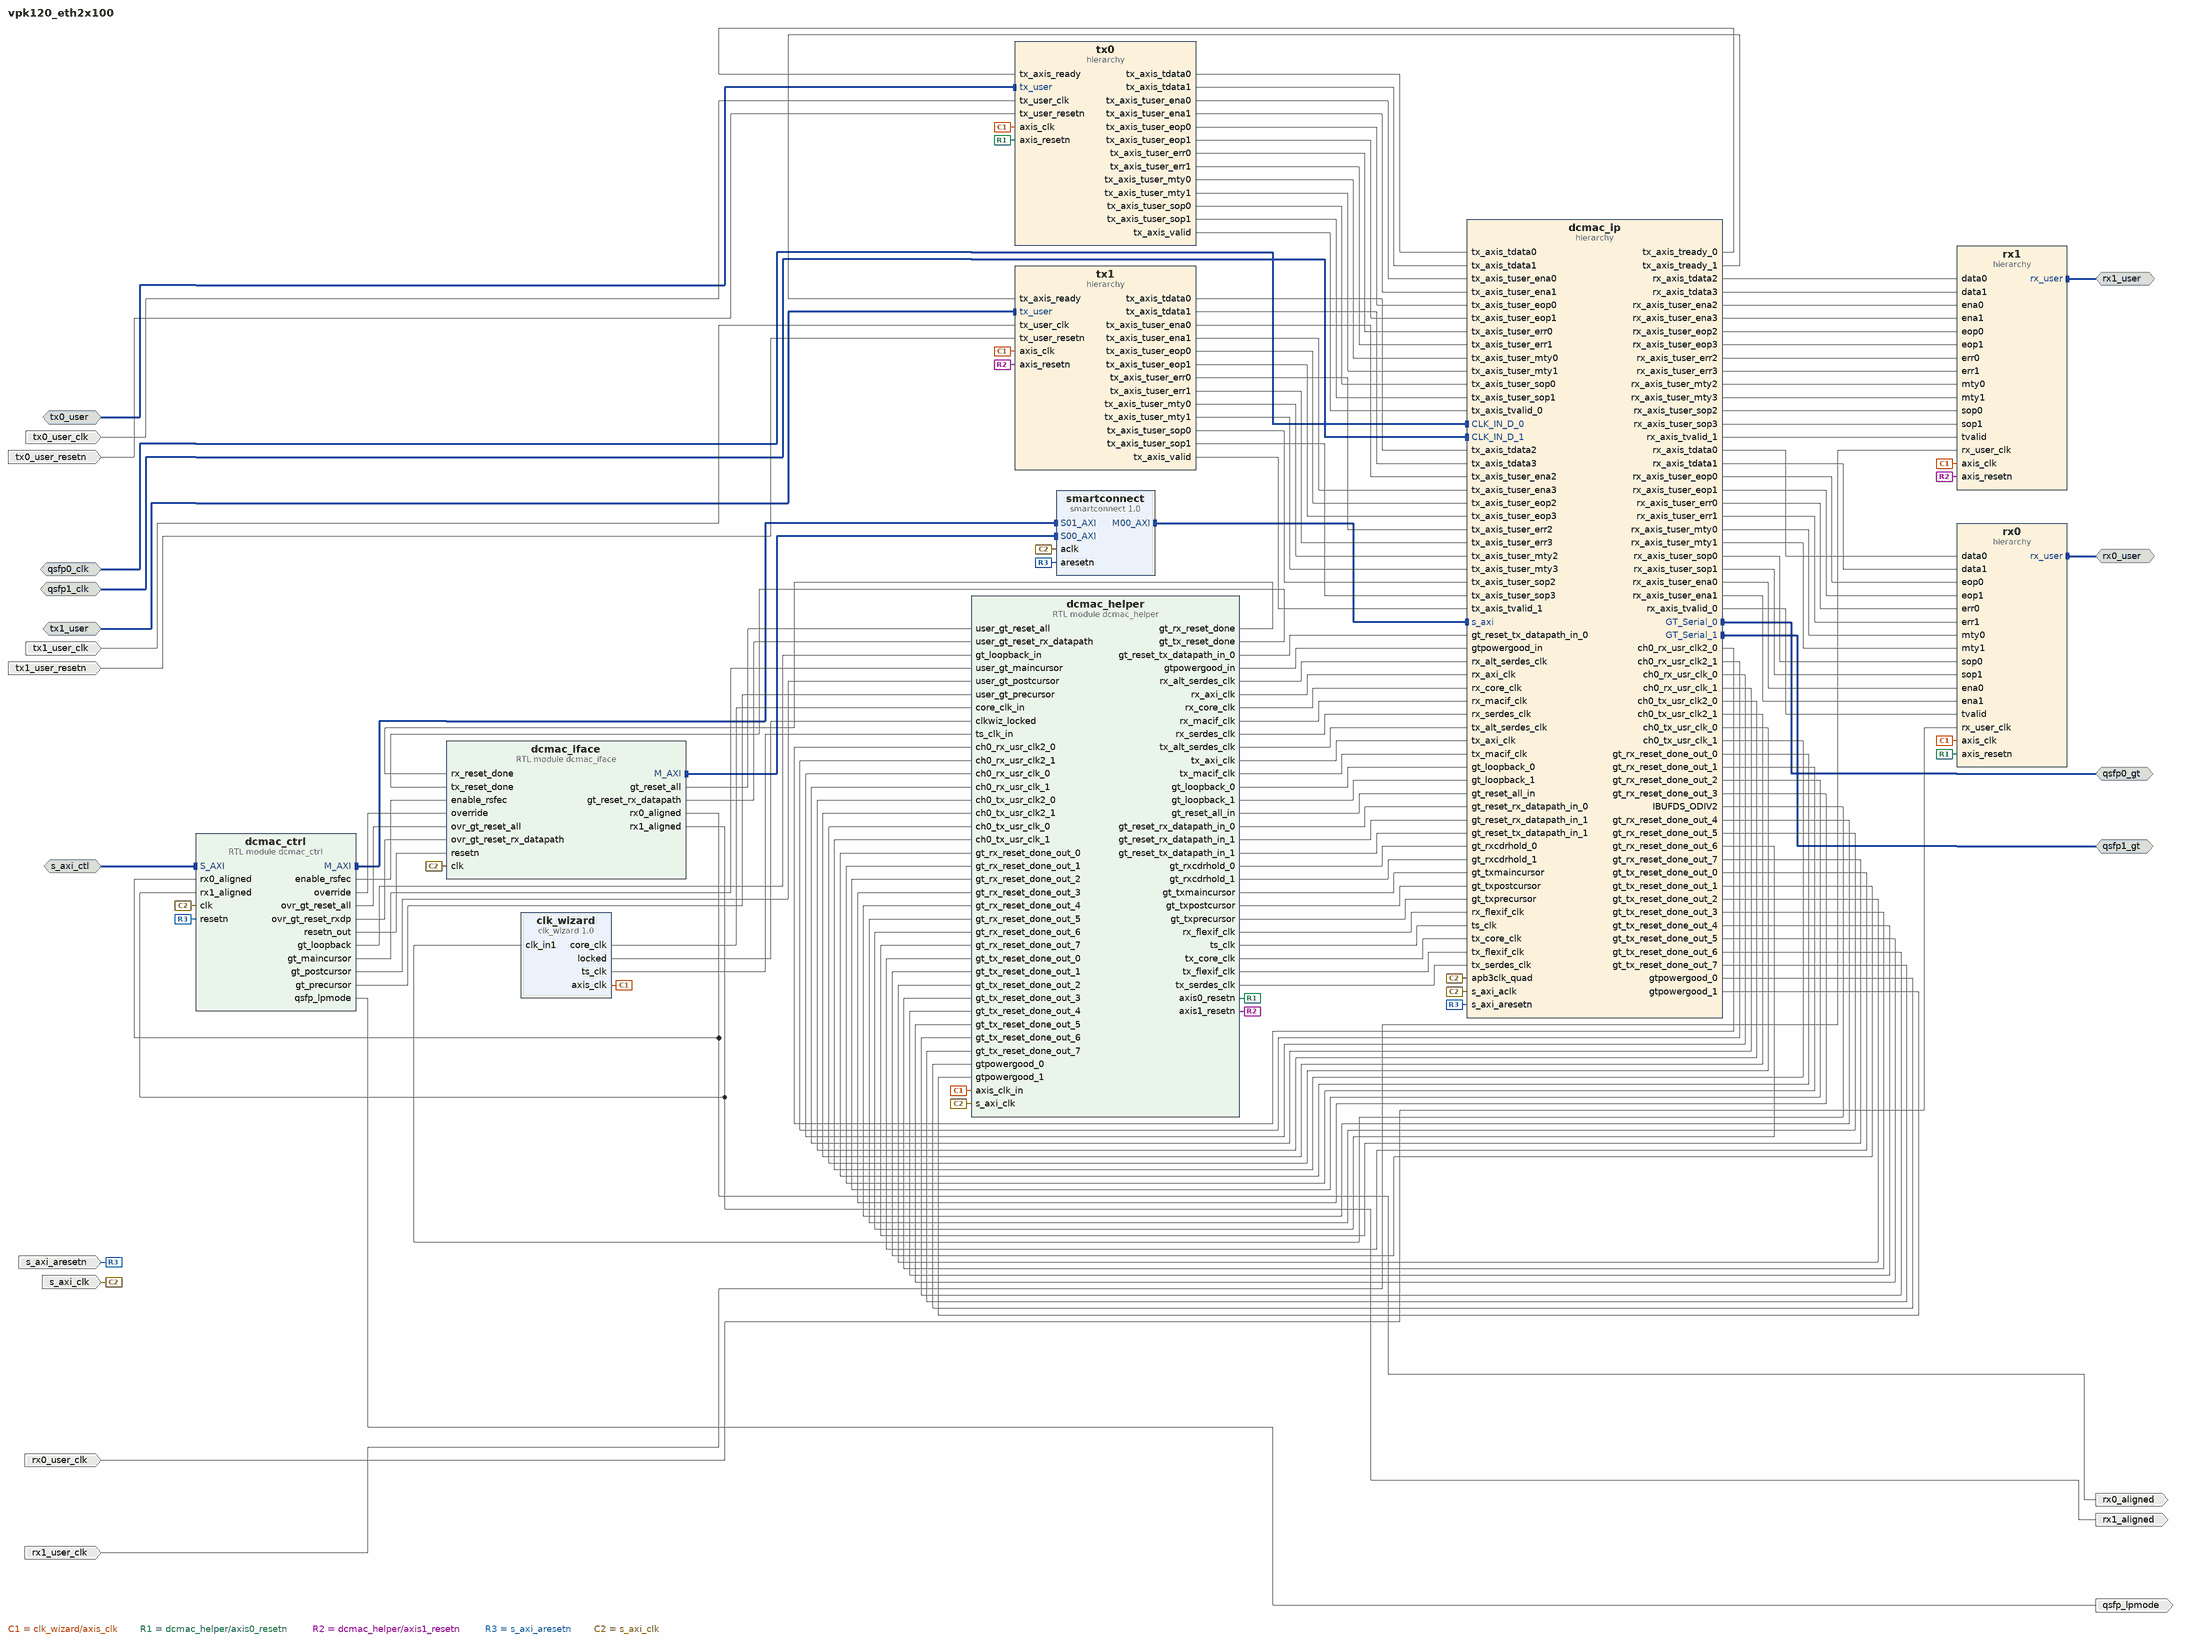
[diagram p0: block diagram of the top level]
# Vivado block design vpk120_eth2x100, xcvp1202-vsva2785-2MP-e-S, Vivado 2024.2
create_bd_design vpk120_eth2x100

create_bd_intf_port -mode Master -vlnv xilinx.com:interface:gt_rtl:1.0 qsfp0_gt
create_bd_intf_port -mode Master -vlnv xilinx.com:interface:gt_rtl:1.0 qsfp1_gt
create_bd_intf_port -mode Slave -vlnv xilinx.com:interface:diff_clock_rtl:1.0 qsfp0_clk
set_property -dict {CONFIG.FREQ_HZ 156250000} [get_bd_intf_ports qsfp0_clk]
create_bd_intf_port -mode Slave -vlnv xilinx.com:interface:diff_clock_rtl:1.0 qsfp1_clk
set_property -dict {CONFIG.FREQ_HZ 156250000} [get_bd_intf_ports qsfp1_clk]
create_bd_intf_port -mode Slave -vlnv xilinx.com:interface:aximm_rtl:1.0 s_axi_ctl
set_property -dict [list \
  CONFIG.ADDR_WIDTH 16 \
  CONFIG.ARUSER_WIDTH 0 \
  CONFIG.AWUSER_WIDTH 0 \
  CONFIG.BUSER_WIDTH 0 \
  CONFIG.DATA_WIDTH 32 \
  CONFIG.FREQ_HZ 249997499 \
  CONFIG.HAS_BRESP 1 \
  CONFIG.HAS_BURST 0 \
  CONFIG.HAS_CACHE 0 \
  CONFIG.HAS_LOCK 0 \
  CONFIG.HAS_PROT 1 \
  CONFIG.HAS_QOS 0 \
  CONFIG.HAS_REGION 0 \
  CONFIG.HAS_RRESP 1 \
  CONFIG.HAS_WSTRB 1 \
  CONFIG.ID_WIDTH 0 \
  CONFIG.NUM_READ_OUTSTANDING 1 \
  CONFIG.NUM_READ_THREADS 1 \
  CONFIG.NUM_WRITE_OUTSTANDING 1 \
  CONFIG.NUM_WRITE_THREADS 1 \
  CONFIG.PROTOCOL AXI4LITE \
  CONFIG.READ_WRITE_MODE READ_WRITE \
  CONFIG.RUSER_BITS_PER_BYTE 0 \
  CONFIG.RUSER_WIDTH 0 \
  CONFIG.WUSER_BITS_PER_BYTE 0 \
  CONFIG.WUSER_WIDTH 0 \
] [get_bd_intf_ports s_axi_ctl]
create_bd_intf_port -mode Slave -vlnv xilinx.com:interface:axis_rtl:1.0 tx0_user
set_property -dict [list \
  CONFIG.FREQ_HZ 250000000 \
  CONFIG.HAS_TKEEP 1 \
  CONFIG.HAS_TLAST 1 \
  CONFIG.HAS_TREADY 1 \
  CONFIG.HAS_TSTRB 0 \
  CONFIG.LAYERED_METADATA undef \
  CONFIG.TDATA_NUM_BYTES 64 \
  CONFIG.TDEST_WIDTH 0 \
  CONFIG.TID_WIDTH 0 \
  CONFIG.TUSER_WIDTH 0 \
] [get_bd_intf_ports tx0_user]
create_bd_intf_port -mode Slave -vlnv xilinx.com:interface:axis_rtl:1.0 tx1_user
set_property -dict [list \
  CONFIG.FREQ_HZ 250000000 \
  CONFIG.HAS_TKEEP 1 \
  CONFIG.HAS_TLAST 1 \
  CONFIG.HAS_TREADY 1 \
  CONFIG.HAS_TSTRB 0 \
  CONFIG.LAYERED_METADATA undef \
  CONFIG.TDATA_NUM_BYTES 64 \
  CONFIG.TDEST_WIDTH 0 \
  CONFIG.TID_WIDTH 0 \
  CONFIG.TUSER_WIDTH 0 \
] [get_bd_intf_ports tx1_user]
create_bd_intf_port -mode Master -vlnv xilinx.com:interface:axis_rtl:1.0 rx1_user
set_property -dict {CONFIG.FREQ_HZ 250000000} [get_bd_intf_ports rx1_user]
create_bd_intf_port -mode Master -vlnv xilinx.com:interface:axis_rtl:1.0 rx0_user
set_property -dict {CONFIG.CLK_DOMAIN vpk120_eth2x100_rx0_user_clk CONFIG.FREQ_HZ 250000000} [get_bd_intf_ports rx0_user]
create_bd_port -dir I -type rst s_axi_aresetn
create_bd_port -dir I -type clk s_axi_clk
set_property -dict {CONFIG.ASSOCIATED_BUSIF s_axi_ctl CONFIG.FREQ_HZ 249997499} [get_bd_ports s_axi_clk]
create_bd_port -dir I tx0_user_resetn
create_bd_port -dir I tx1_user_resetn
create_bd_port -dir I -type clk tx0_user_clk
set_property -dict {CONFIG.ASSOCIATED_BUSIF tx0_user CONFIG.FREQ_HZ 250000000} [get_bd_ports tx0_user_clk]
create_bd_port -dir I -type clk tx1_user_clk
set_property -dict {CONFIG.ASSOCIATED_BUSIF tx1_user CONFIG.FREQ_HZ 250000000} [get_bd_ports tx1_user_clk]
create_bd_port -dir I -type clk rx1_user_clk
set_property -dict {CONFIG.FREQ_HZ 250000000} [get_bd_ports rx1_user_clk]
create_bd_port -dir I -type clk rx0_user_clk
set_property -dict [list \
  CONFIG.ASSOCIATED_BUSIF rx0_user \
  CONFIG.CLK_DOMAIN vpk120_eth2x100_rx0_user_clk \
  CONFIG.FREQ_HZ 250000000 \
] [get_bd_ports rx0_user_clk]
create_bd_port -dir O rx0_aligned
create_bd_port -dir O rx1_aligned
create_bd_port -dir O qsfp_lpmode

create_bd_cell -type hier dcmac_ip
create_bd_cell -type module -reference dcmac_helper dcmac_helper
create_bd_cell -type ip -vlnv xilinx.com:ip:clk_wizard:1.0 clk_wizard
set_property -dict [list \
  CONFIG.CLKOUT_DRIVES BUFG,BUFG,BUFG,BUFG,BUFG,BUFG,BUFG \
  CONFIG.CLKOUT_DYN_PS None,None,None,None,None,None,None \
  CONFIG.CLKOUT_GROUPING Auto,Auto,Auto,Auto,Auto,Auto,Auto \
  CONFIG.CLKOUT_MATCHED_ROUTING false,false,false,false,false,false,false \
  CONFIG.CLKOUT_PORT core_clk,axis_clk,ts_clk,clk_out4,clk_out5,clk_out6,clk_out7 \
  CONFIG.CLKOUT_REQUESTED_DUTY_CYCLE 50.000,50.000,50.000,50.000,50.000,50.000,50.000 \
  CONFIG.CLKOUT_REQUESTED_OUT_FREQUENCY 782,390.625,300,100.000,100.000,100.000,100.000 \
  CONFIG.CLKOUT_REQUESTED_PHASE 0.000,0.000,0.000,0.000,0.000,0.000,0.000 \
  CONFIG.CLKOUT_USED true,true,true,false,false,false,false \
  CONFIG.PRIM_SOURCE Global_buffer \
  CONFIG.USE_LOCKED true \
] [get_bd_cells clk_wizard]
create_bd_cell -type module -reference dcmac_ctrl dcmac_ctrl
create_bd_cell -type hier rx0
create_bd_cell -type hier tx0
create_bd_cell -type hier tx1
create_bd_cell -type hier rx1
create_bd_cell -type ip -vlnv xilinx.com:ip:smartconnect:1.0 smartconnect
create_bd_cell -type module -reference dcmac_iface dcmac_iface

# ---- hierarchy /dcmac_ip ----
current_bd_instance /dcmac_ip
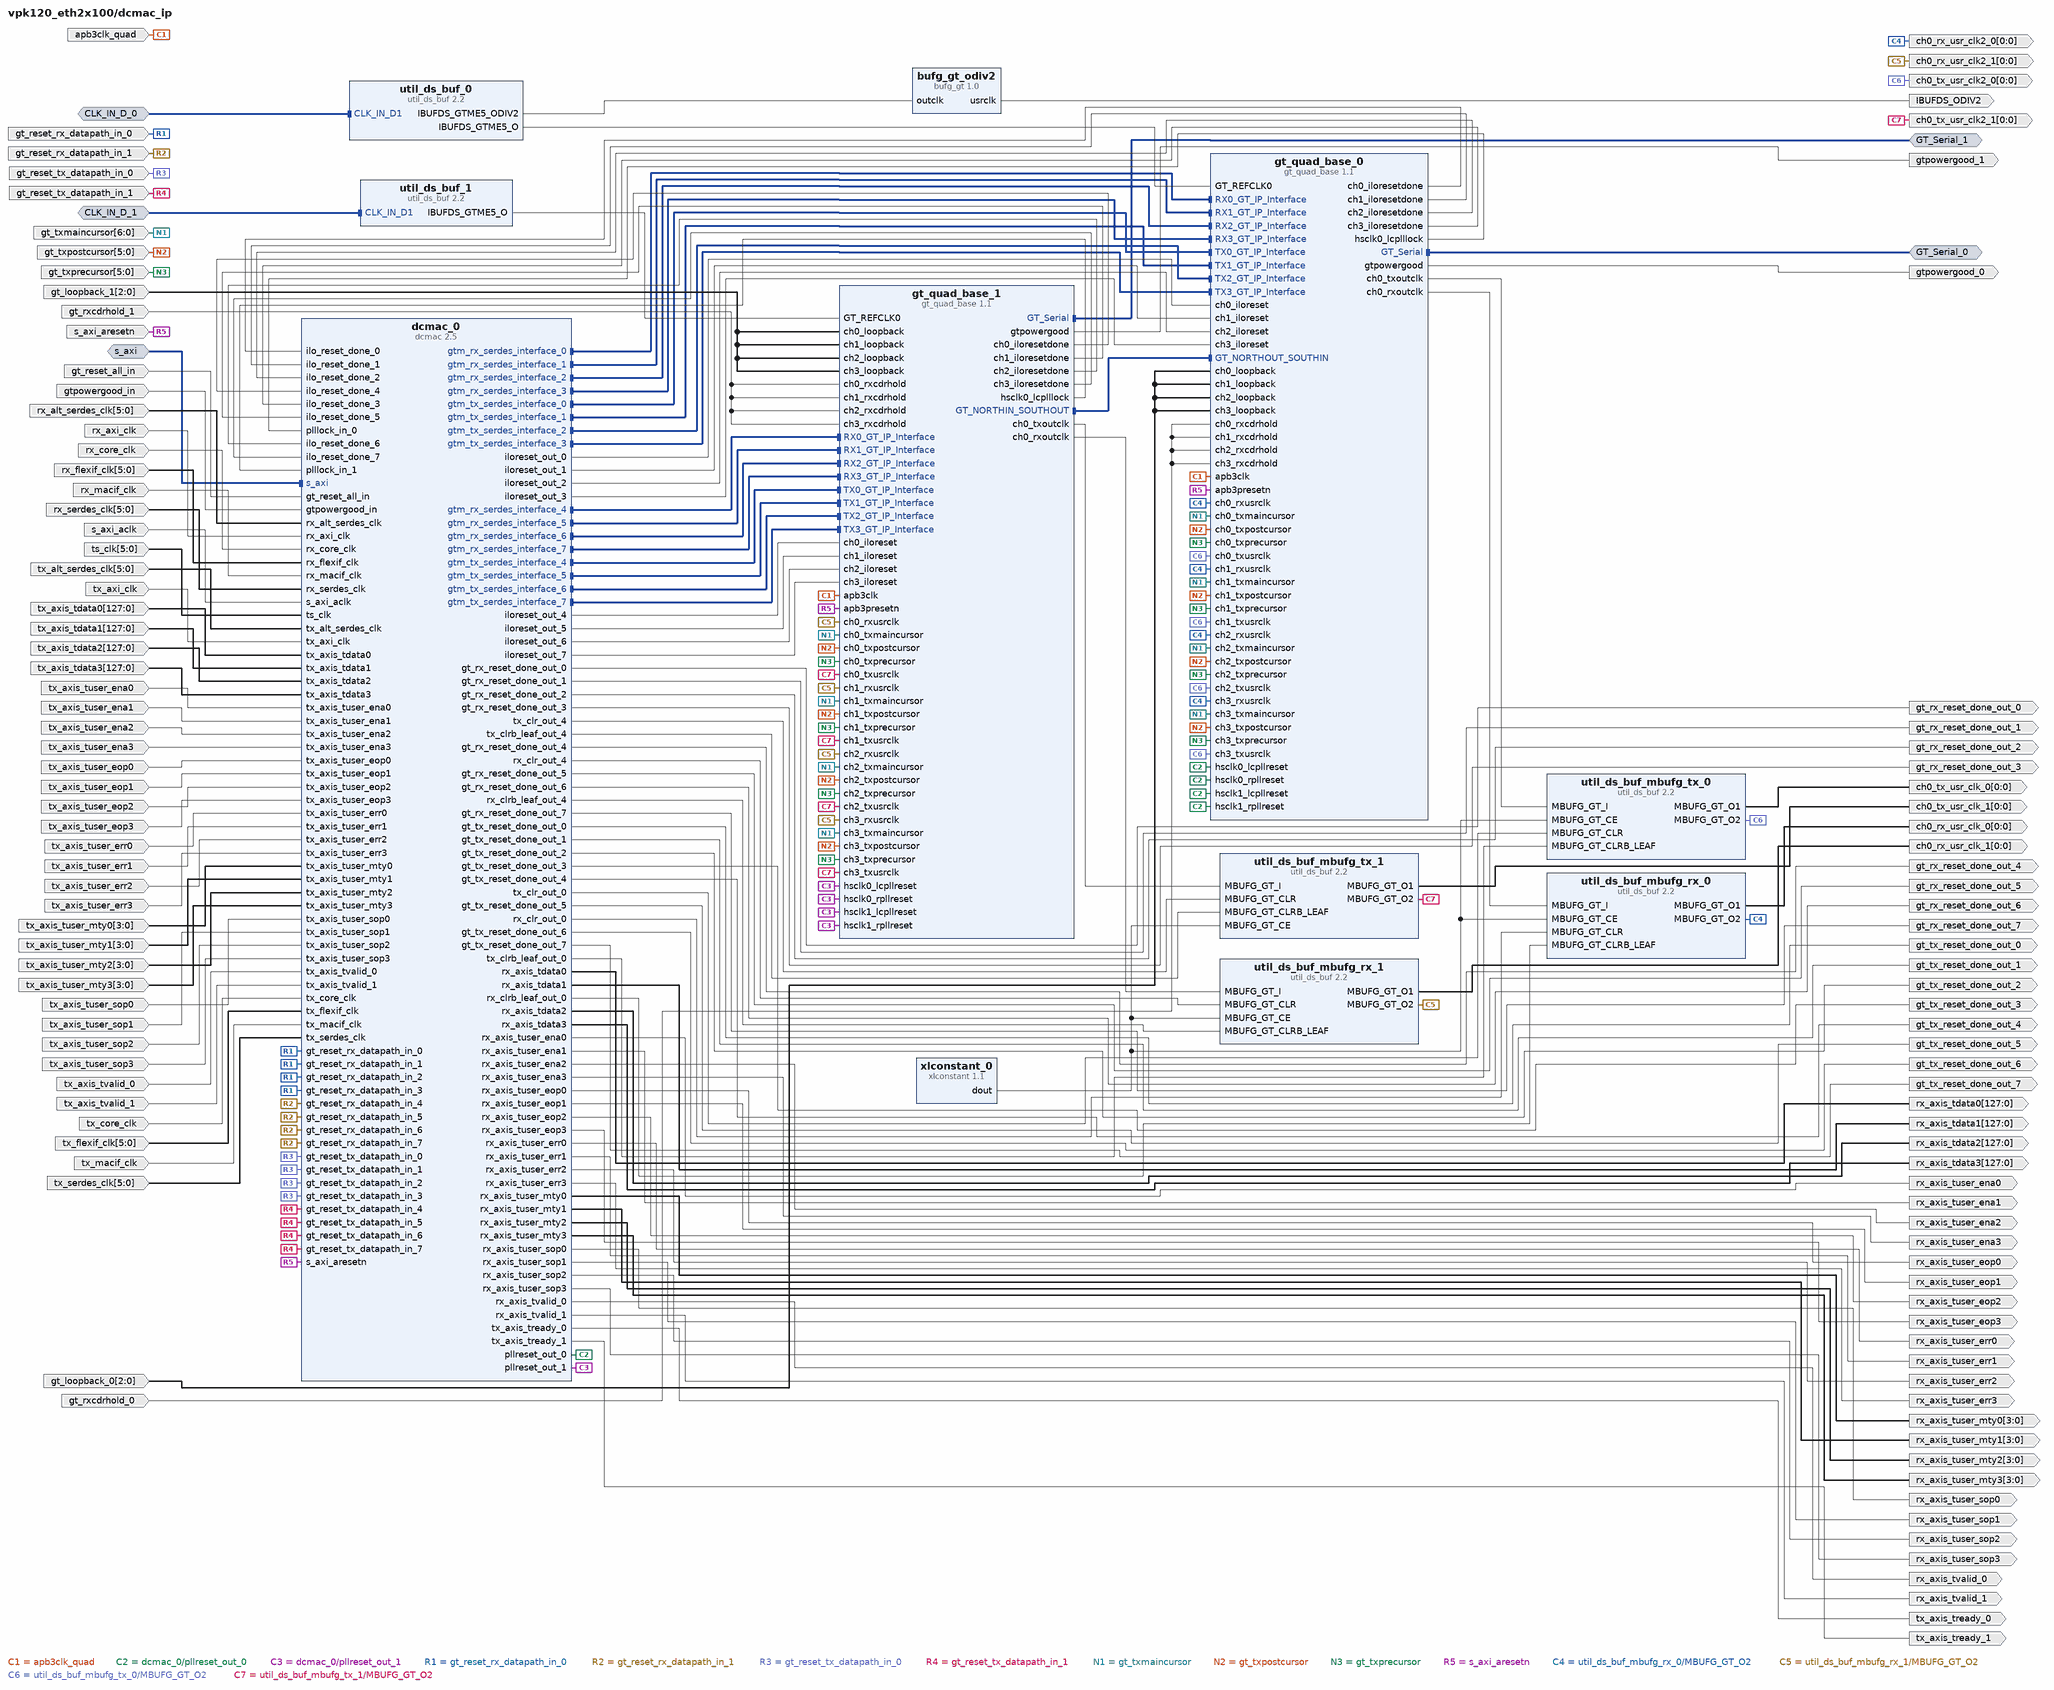
[diagram p1: block diagram inside /dcmac_ip]
create_bd_intf_pin -mode Slave -vlnv xilinx.com:interface:diff_clock_rtl:1.0 CLK_IN_D_0
create_bd_intf_pin -mode Slave -vlnv xilinx.com:interface:diff_clock_rtl:1.0 CLK_IN_D_1
create_bd_intf_pin -mode Master -vlnv xilinx.com:interface:gt_rtl:1.0 GT_Serial_0
create_bd_intf_pin -mode Master -vlnv xilinx.com:interface:gt_rtl:1.0 GT_Serial_1
create_bd_intf_pin -mode Slave -vlnv xilinx.com:interface:aximm_rtl:1.0 s_axi
create_bd_pin -dir O -from 0 -to 0 -type gt_usrclk ch0_rx_usr_clk_1
create_bd_pin -dir O -from 0 -to 0 -type gt_usrclk ch0_rx_usr_clk2_1
create_bd_pin -dir O gtpowergood_0
create_bd_pin -dir I -from 5 -to 0 gt_txpostcursor
create_bd_pin -dir I -from 5 -to 0 gt_txprecursor
create_bd_pin -dir I -from 6 -to 0 gt_txmaincursor
create_bd_pin -dir O -from 0 -to 0 -type gt_usrclk ch0_tx_usr_clk2_0
create_bd_pin -dir I gt_rxcdrhold_1
create_bd_pin -dir O -from 0 -to 0 -type gt_usrclk ch0_rx_usr_clk2_0
create_bd_pin -dir I -from 2 -to 0 gt_loopback_0
create_bd_pin -dir I -type clk apb3clk_quad
create_bd_pin -dir I -type rst s_axi_aresetn
create_bd_pin -dir O -type gt_usrclk IBUFDS_ODIV2
create_bd_pin -dir O -from 0 -to 0 -type gt_usrclk ch0_tx_usr_clk_0
create_bd_pin -dir O -from 0 -to 0 -type gt_usrclk ch0_tx_usr_clk_1
create_bd_pin -dir O -from 0 -to 0 -type gt_usrclk ch0_tx_usr_clk2_1
create_bd_pin -dir O gtpowergood_1
create_bd_pin -dir I -from 2 -to 0 gt_loopback_1
create_bd_pin -dir O -from 0 -to 0 -type gt_usrclk ch0_rx_usr_clk_0
create_bd_pin -dir I -type clk s_axi_aclk
create_bd_pin -dir O -from 127 -to 0 rx_axis_tdata0
create_bd_pin -dir O -from 127 -to 0 rx_axis_tdata1
create_bd_pin -dir O -from 127 -to 0 rx_axis_tdata2
create_bd_pin -dir O -from 127 -to 0 rx_axis_tdata3
create_bd_pin -dir O rx_axis_tuser_ena0
create_bd_pin -dir O rx_axis_tuser_ena1
create_bd_pin -dir O rx_axis_tuser_ena2
create_bd_pin -dir O rx_axis_tuser_ena3
create_bd_pin -dir O rx_axis_tuser_eop0
create_bd_pin -dir O rx_axis_tuser_eop1
create_bd_pin -dir O rx_axis_tuser_eop2
create_bd_pin -dir O rx_axis_tuser_eop3
create_bd_pin -dir O rx_axis_tuser_err0
create_bd_pin -dir O rx_axis_tuser_err1
create_bd_pin -dir O rx_axis_tuser_err2
create_bd_pin -dir O rx_axis_tuser_err3
create_bd_pin -dir O -from 3 -to 0 rx_axis_tuser_mty0
create_bd_pin -dir O -from 3 -to 0 rx_axis_tuser_mty1
create_bd_pin -dir O -from 3 -to 0 rx_axis_tuser_mty2
create_bd_pin -dir O -from 3 -to 0 rx_axis_tuser_mty3
create_bd_pin -dir O rx_axis_tuser_sop0
create_bd_pin -dir O rx_axis_tuser_sop1
create_bd_pin -dir O rx_axis_tuser_sop2
create_bd_pin -dir O rx_axis_tuser_sop3
create_bd_pin -dir O rx_axis_tvalid_0
create_bd_pin -dir O rx_axis_tvalid_1
create_bd_pin -dir O tx_axis_tready_0
create_bd_pin -dir O tx_axis_tready_1
create_bd_pin -dir I -from 5 -to 0 -type gt_usrclk rx_alt_serdes_clk
create_bd_pin -dir I -type clk rx_axi_clk
create_bd_pin -dir I -type clk rx_core_clk
create_bd_pin -dir I -from 5 -to 0 -type clk rx_flexif_clk
create_bd_pin -dir I -type clk rx_macif_clk
create_bd_pin -dir I -from 5 -to 0 -type gt_usrclk rx_serdes_clk
create_bd_pin -dir I -from 5 -to 0 -type clk ts_clk
create_bd_pin -dir I -from 5 -to 0 -type gt_usrclk tx_alt_serdes_clk
create_bd_pin -dir I -from 127 -to 0 tx_axis_tdata0
create_bd_pin -dir I -from 127 -to 0 tx_axis_tdata1
create_bd_pin -dir I -from 127 -to 0 tx_axis_tdata2
create_bd_pin -dir I -from 127 -to 0 tx_axis_tdata3
create_bd_pin -dir I tx_axis_tuser_ena0
create_bd_pin -dir I tx_axis_tuser_ena1
create_bd_pin -dir I tx_axis_tuser_ena2
create_bd_pin -dir I tx_axis_tuser_ena3
create_bd_pin -dir I tx_axis_tuser_eop0
create_bd_pin -dir I tx_axis_tuser_eop1
create_bd_pin -dir I tx_axis_tuser_eop2
create_bd_pin -dir I tx_axis_tuser_eop3
create_bd_pin -dir I tx_axis_tuser_err0
create_bd_pin -dir I tx_axis_tuser_err1
create_bd_pin -dir I tx_axis_tuser_err2
create_bd_pin -dir I tx_axis_tuser_err3
create_bd_pin -dir I -from 3 -to 0 tx_axis_tuser_mty0
create_bd_pin -dir I -from 3 -to 0 tx_axis_tuser_mty1
create_bd_pin -dir I -from 3 -to 0 tx_axis_tuser_mty2
create_bd_pin -dir I -from 3 -to 0 tx_axis_tuser_mty3
create_bd_pin -dir I tx_axis_tuser_sop0
create_bd_pin -dir I tx_axis_tuser_sop1
create_bd_pin -dir I tx_axis_tuser_sop2
create_bd_pin -dir I tx_axis_tuser_sop3
create_bd_pin -dir I tx_axis_tvalid_0
create_bd_pin -dir I tx_axis_tvalid_1
create_bd_pin -dir I -type clk tx_axi_clk
create_bd_pin -dir I -type clk tx_core_clk
create_bd_pin -dir I -from 5 -to 0 -type clk tx_flexif_clk
create_bd_pin -dir I -type clk tx_macif_clk
create_bd_pin -dir I -from 5 -to 0 -type gt_usrclk tx_serdes_clk
create_bd_pin -dir I gtpowergood_in
create_bd_pin -dir I gt_reset_all_in
create_bd_pin -dir I gt_reset_tx_datapath_in_0
create_bd_pin -dir I gt_reset_rx_datapath_in_0
create_bd_pin -dir I gt_reset_tx_datapath_in_1
create_bd_pin -dir I gt_reset_rx_datapath_in_1
create_bd_pin -dir I gt_rxcdrhold_0
create_bd_pin -dir O gt_tx_reset_done_out_0
create_bd_pin -dir O gt_tx_reset_done_out_5
create_bd_pin -dir O gt_rx_reset_done_out_0
create_bd_pin -dir O gt_tx_reset_done_out_1
create_bd_pin -dir O gt_tx_reset_done_out_3
create_bd_pin -dir O gt_tx_reset_done_out_4
create_bd_pin -dir O gt_rx_reset_done_out_2
create_bd_pin -dir O gt_tx_reset_done_out_6
create_bd_pin -dir O gt_rx_reset_done_out_3
create_bd_pin -dir O gt_rx_reset_done_out_4
create_bd_pin -dir O gt_rx_reset_done_out_1
create_bd_pin -dir O gt_tx_reset_done_out_7
create_bd_pin -dir O gt_tx_reset_done_out_2
create_bd_pin -dir O gt_rx_reset_done_out_7
create_bd_pin -dir O gt_rx_reset_done_out_5
create_bd_pin -dir O gt_rx_reset_done_out_6

create_bd_cell -type ip -vlnv xilinx.com:ip:util_ds_buf:2.2 util_ds_buf_mbufg_rx_1
set_property -dict {CONFIG.C_BUFG_GT_SYNC true CONFIG.C_BUF_TYPE MBUFG_GT} [get_bd_cells util_ds_buf_mbufg_rx_1]
create_bd_cell -type ip -vlnv xilinx.com:ip:util_ds_buf:2.2 util_ds_buf_0
set_property -dict {CONFIG.C_BUF_TYPE IBUFDS_GTME5} [get_bd_cells util_ds_buf_0]
create_bd_cell -type ip -vlnv xilinx.com:ip:util_ds_buf:2.2 util_ds_buf_1
set_property -dict {CONFIG.C_BUF_TYPE IBUFDS_GTME5} [get_bd_cells util_ds_buf_1]
create_bd_cell -type ip -vlnv xilinx.com:ip:gt_quad_base:1.1 gt_quad_base_0
set_property -dict [list \
  CONFIG.APB3_CLK_FREQUENCY 249.997499 \
  CONFIG.PORTS_INFO_DICT {LANE_SEL_DICT {PROT0 {RX0 RX1 RX2 RX3 TX0 TX1 TX2 TX3}} GT_TYPE GTM REG_CONF_INTF APB3_INTF BOARD_PARAMETER { }} \
  CONFIG.REFCLK_LIST {{/qsfp0_clk_clk_p[0]}} \
  CONFIG.REFCLK_STRING {HSCLK0_LCPLLGTREFCLK0 refclk_PROT0_R0_156.25_MHz_unique1} \
] [get_bd_cells gt_quad_base_0]
create_bd_cell -type ip -vlnv xilinx.com:ip:bufg_gt:1.0 bufg_gt_odiv2
create_bd_cell -type ip -vlnv xilinx.com:ip:util_ds_buf:2.2 util_ds_buf_mbufg_tx_0
set_property -dict {CONFIG.C_BUFG_GT_SYNC true CONFIG.C_BUF_TYPE MBUFG_GT} [get_bd_cells util_ds_buf_mbufg_tx_0]
create_bd_cell -type ip -vlnv xilinx.com:ip:util_ds_buf:2.2 util_ds_buf_mbufg_tx_1
set_property -dict {CONFIG.C_BUFG_GT_SYNC true CONFIG.C_BUF_TYPE MBUFG_GT} [get_bd_cells util_ds_buf_mbufg_tx_1]
create_bd_cell -type ip -vlnv xilinx.com:ip:gt_quad_base:1.1 gt_quad_base_1
set_property -dict [list \
  CONFIG.APB3_CLK_FREQUENCY 249.997499 \
  CONFIG.PORTS_INFO_DICT {LANE_SEL_DICT {PROT0 {RX0 RX1 RX2 RX3 TX0 TX1 TX2 TX3}} GT_TYPE GTM REG_CONF_INTF APB3_INTF BOARD_PARAMETER { }} \
  CONFIG.REFCLK_LIST {{/qsfp1_clk_clk_p[0]}} \
  CONFIG.REFCLK_STRING {HSCLK0_LCPLLGTREFCLK0 refclk_PROT0_R0_156.25_MHz_unique1} \
] [get_bd_cells gt_quad_base_1]
create_bd_cell -type ip -vlnv xilinx.com:ip:util_ds_buf:2.2 util_ds_buf_mbufg_rx_0
set_property -dict {CONFIG.C_BUFG_GT_SYNC true CONFIG.C_BUF_TYPE MBUFG_GT} [get_bd_cells util_ds_buf_mbufg_rx_0]
create_bd_cell -type ip -vlnv xilinx.com:ip:dcmac:2.5 dcmac_0
set_property -dict [list \
  CONFIG.MAC_PORT0_CONFIG_C0 100CAUI-4 \
  CONFIG.MAC_PORT0_RX_STRIP_C0 1 \
  CONFIG.MAC_PORT1_RX_STRIP_C0 1 \
  CONFIG.MAC_PORT2_ENABLE_C0 0 \
  CONFIG.MAC_PORT3_ENABLE_C0 0 \
  CONFIG.MAC_PORT4_ENABLE_C0 0 \
  CONFIG.MAC_PORT5_ENABLE_C0 0 \
] [get_bd_cells dcmac_0]
create_bd_cell -type ip -vlnv xilinx.com:ip:xlconstant:1.1 xlconstant_0
set_property -dict {CONFIG.CONST_VAL 1 CONFIG.CONST_WIDTH 1} [get_bd_cells xlconstant_0]

# ---- hierarchy /rx0 ----
current_bd_instance /rx0
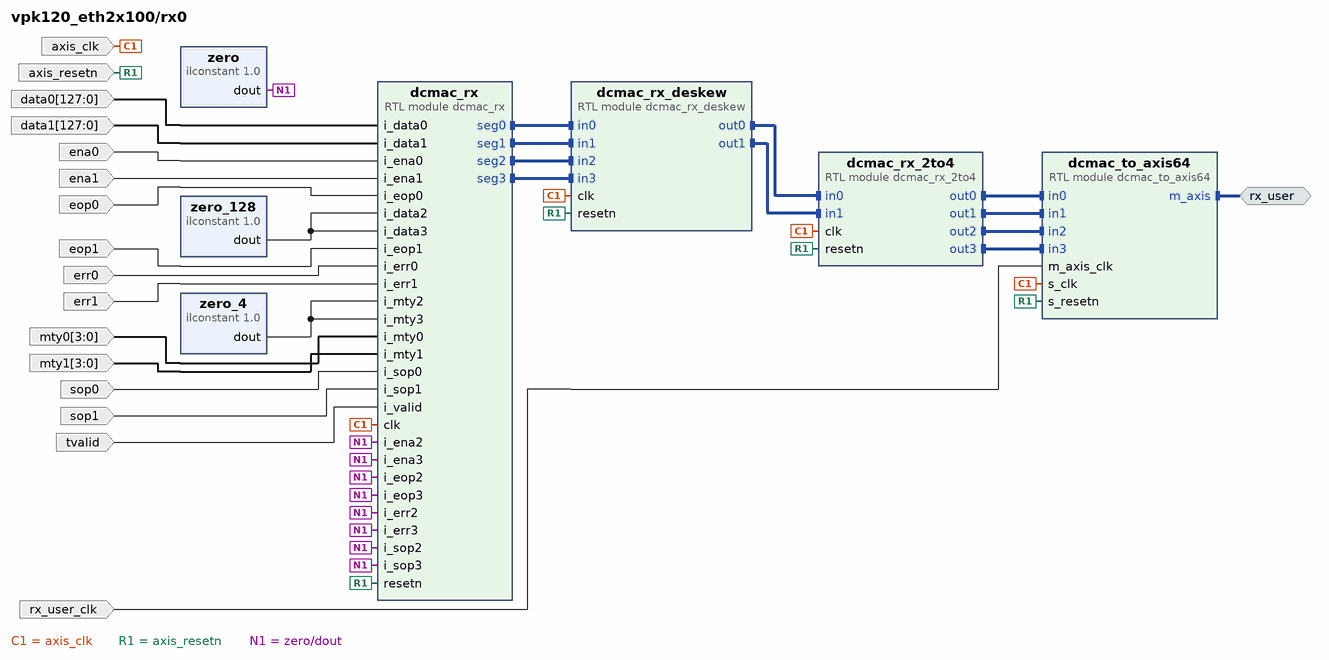
[diagram p2: block diagram inside /rx0]
create_bd_intf_pin -mode Master -vlnv xilinx.com:interface:axis_rtl:1.0 rx_user
create_bd_pin -dir I -type clk axis_clk
create_bd_pin -dir I -type rst axis_resetn
create_bd_pin -dir I tvalid
create_bd_pin -dir I -from 127 -to 0 data0
create_bd_pin -dir I -from 127 -to 0 data1
create_bd_pin -dir I ena0
create_bd_pin -dir I ena1
create_bd_pin -dir I err0
create_bd_pin -dir I err1
create_bd_pin -dir I sop0
create_bd_pin -dir I sop1
create_bd_pin -dir I eop0
create_bd_pin -dir I eop1
create_bd_pin -dir I -from 3 -to 0 mty0
create_bd_pin -dir I -from 3 -to 0 mty1
create_bd_pin -dir I -type clk rx_user_clk

create_bd_cell -type module -reference dcmac_rx dcmac_rx
create_bd_cell -type inline_hdl -vlnv xilinx.com:inline_hdl:ilconstant:1.0 zero
set_property -dict {CONFIG.CONST_VAL 0} [get_bd_cells zero]
create_bd_cell -type inline_hdl -vlnv xilinx.com:inline_hdl:ilconstant:1.0 zero_128
set_property -dict {CONFIG.CONST_VAL 0 CONFIG.CONST_WIDTH 128} [get_bd_cells zero_128]
create_bd_cell -type inline_hdl -vlnv xilinx.com:inline_hdl:ilconstant:1.0 zero_4
set_property -dict {CONFIG.CONST_VAL 0 CONFIG.CONST_WIDTH 4} [get_bd_cells zero_4]
create_bd_cell -type module -reference dcmac_rx_deskew dcmac_rx_deskew
create_bd_cell -type module -reference dcmac_rx_2to4 dcmac_rx_2to4
create_bd_cell -type module -reference dcmac_to_axis64 dcmac_to_axis64

# ---- hierarchy /tx0 ----
current_bd_instance /tx0
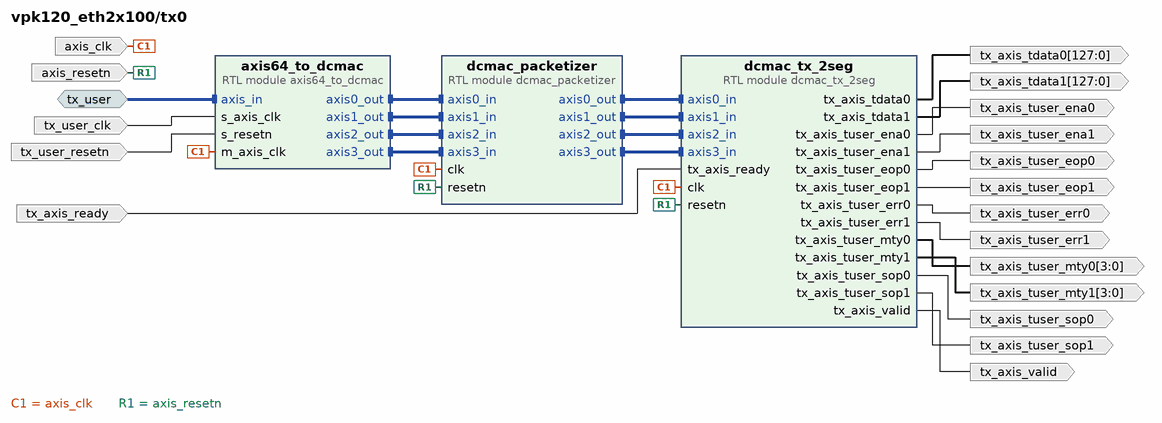
[diagram p3: block diagram inside /tx0]
create_bd_intf_pin -mode Slave -vlnv xilinx.com:interface:axis_rtl:1.0 tx_user
create_bd_pin -dir I -type clk axis_clk
create_bd_pin -dir I -type rst axis_resetn
create_bd_pin -dir O -from 127 -to 0 tx_axis_tdata0
create_bd_pin -dir O -from 127 -to 0 tx_axis_tdata1
create_bd_pin -dir O tx_axis_tuser_ena0
create_bd_pin -dir O tx_axis_tuser_ena1
create_bd_pin -dir O tx_axis_tuser_sop0
create_bd_pin -dir O tx_axis_tuser_sop1
create_bd_pin -dir O tx_axis_tuser_eop0
create_bd_pin -dir O tx_axis_tuser_eop1
create_bd_pin -dir O -from 3 -to 0 tx_axis_tuser_mty0
create_bd_pin -dir O -from 3 -to 0 tx_axis_tuser_mty1
create_bd_pin -dir O tx_axis_tuser_err0
create_bd_pin -dir O tx_axis_tuser_err1
create_bd_pin -dir O tx_axis_valid
create_bd_pin -dir I tx_axis_ready
create_bd_pin -dir I -type clk tx_user_clk
create_bd_pin -dir I -type rst tx_user_resetn

create_bd_cell -type module -reference dcmac_packetizer dcmac_packetizer
create_bd_cell -type module -reference dcmac_tx_2seg dcmac_tx_2seg
create_bd_cell -type module -reference axis64_to_dcmac axis64_to_dcmac

# ---- hierarchy /tx1 ----
current_bd_instance /tx1
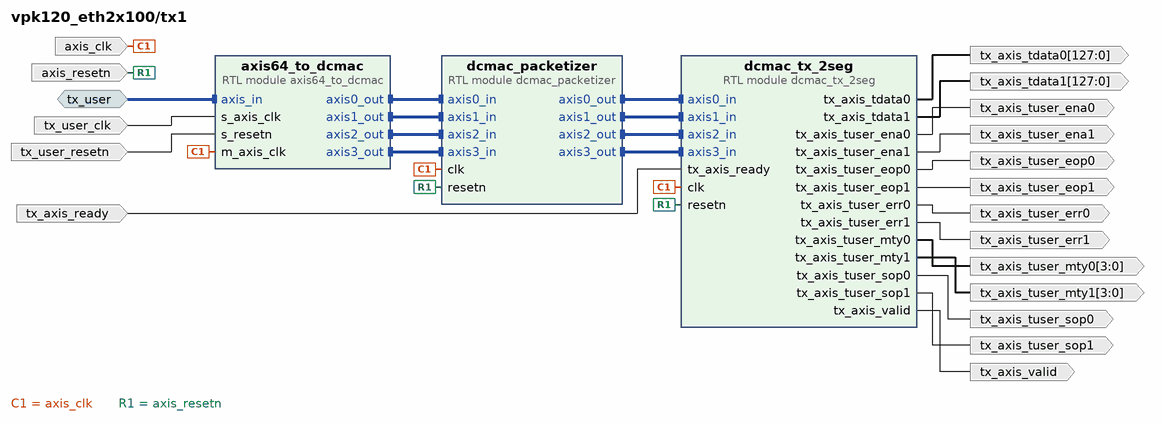
[diagram p4: block diagram inside /tx1]
create_bd_intf_pin -mode Slave -vlnv xilinx.com:interface:axis_rtl:1.0 tx_user
create_bd_pin -dir I -type clk axis_clk
create_bd_pin -dir I -type rst axis_resetn
create_bd_pin -dir O -from 127 -to 0 tx_axis_tdata0
create_bd_pin -dir O -from 127 -to 0 tx_axis_tdata1
create_bd_pin -dir O tx_axis_tuser_ena0
create_bd_pin -dir O tx_axis_tuser_ena1
create_bd_pin -dir O tx_axis_tuser_sop0
create_bd_pin -dir O tx_axis_tuser_sop1
create_bd_pin -dir O tx_axis_tuser_eop0
create_bd_pin -dir O tx_axis_tuser_eop1
create_bd_pin -dir O -from 3 -to 0 tx_axis_tuser_mty0
create_bd_pin -dir O -from 3 -to 0 tx_axis_tuser_mty1
create_bd_pin -dir O tx_axis_tuser_err0
create_bd_pin -dir O tx_axis_tuser_err1
create_bd_pin -dir O tx_axis_valid
create_bd_pin -dir I tx_axis_ready
create_bd_pin -dir I -type clk tx_user_clk
create_bd_pin -dir I -type rst tx_user_resetn

create_bd_cell -type module -reference dcmac_packetizer dcmac_packetizer
create_bd_cell -type module -reference dcmac_tx_2seg dcmac_tx_2seg
create_bd_cell -type module -reference axis64_to_dcmac axis64_to_dcmac

# ---- hierarchy /rx1 ----
current_bd_instance /rx1
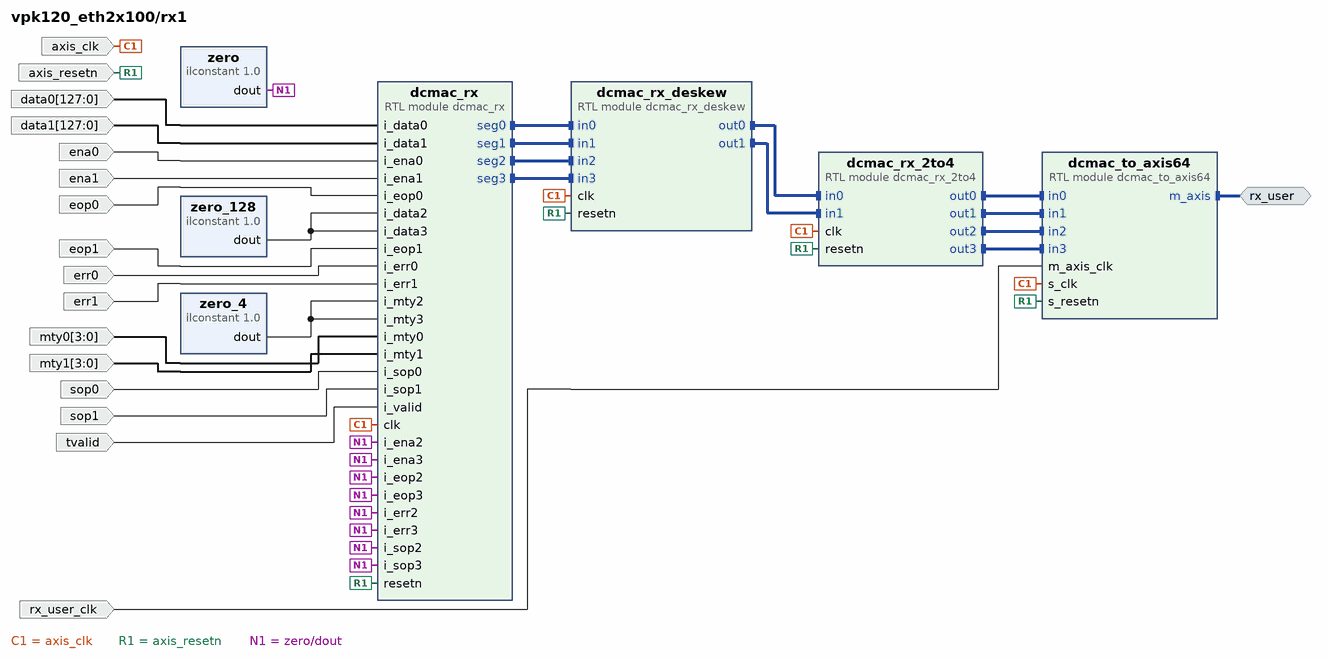
[diagram p5: block diagram inside /rx1]
create_bd_intf_pin -mode Master -vlnv xilinx.com:interface:axis_rtl:1.0 rx_user
create_bd_pin -dir I -type clk axis_clk
create_bd_pin -dir I -type rst axis_resetn
create_bd_pin -dir I tvalid
create_bd_pin -dir I -from 127 -to 0 data0
create_bd_pin -dir I -from 127 -to 0 data1
create_bd_pin -dir I ena0
create_bd_pin -dir I ena1
create_bd_pin -dir I err0
create_bd_pin -dir I err1
create_bd_pin -dir I sop0
create_bd_pin -dir I sop1
create_bd_pin -dir I eop0
create_bd_pin -dir I eop1
create_bd_pin -dir I -from 3 -to 0 mty0
create_bd_pin -dir I -from 3 -to 0 mty1
create_bd_pin -dir I -type clk rx_user_clk

create_bd_cell -type module -reference dcmac_rx dcmac_rx
create_bd_cell -type inline_hdl -vlnv xilinx.com:inline_hdl:ilconstant:1.0 zero
set_property -dict {CONFIG.CONST_VAL 0} [get_bd_cells zero]
create_bd_cell -type inline_hdl -vlnv xilinx.com:inline_hdl:ilconstant:1.0 zero_128
set_property -dict {CONFIG.CONST_VAL 0 CONFIG.CONST_WIDTH 128} [get_bd_cells zero_128]
create_bd_cell -type inline_hdl -vlnv xilinx.com:inline_hdl:ilconstant:1.0 zero_4
set_property -dict {CONFIG.CONST_VAL 0 CONFIG.CONST_WIDTH 4} [get_bd_cells zero_4]
create_bd_cell -type module -reference dcmac_rx_deskew dcmac_rx_deskew
create_bd_cell -type module -reference dcmac_rx_2to4 dcmac_rx_2to4
create_bd_cell -type module -reference dcmac_to_axis64 dcmac_to_axis64

# ---- connections ----

current_bd_instance /dcmac_ip
connect_bd_intf_net [get_bd_intf_pins CLK_IN_D_0] [get_bd_intf_pins util_ds_buf_0/CLK_IN_D1]
connect_bd_intf_net [get_bd_intf_pins CLK_IN_D_1] [get_bd_intf_pins util_ds_buf_1/CLK_IN_D1]
connect_bd_intf_net [get_bd_intf_pins dcmac_0/gtm_rx_serdes_interface_0] [get_bd_intf_pins gt_quad_base_0/RX0_GT_IP_Interface]
connect_bd_intf_net [get_bd_intf_pins dcmac_0/gtm_rx_serdes_interface_1] [get_bd_intf_pins gt_quad_base_0/RX1_GT_IP_Interface]
connect_bd_intf_net [get_bd_intf_pins dcmac_0/gtm_rx_serdes_interface_2] [get_bd_intf_pins gt_quad_base_0/RX2_GT_IP_Interface]
connect_bd_intf_net [get_bd_intf_pins dcmac_0/gtm_rx_serdes_interface_3] [get_bd_intf_pins gt_quad_base_0/RX3_GT_IP_Interface]
connect_bd_intf_net [get_bd_intf_pins dcmac_0/gtm_rx_serdes_interface_4] [get_bd_intf_pins gt_quad_base_1/RX0_GT_IP_Interface]
connect_bd_intf_net [get_bd_intf_pins dcmac_0/gtm_rx_serdes_interface_5] [get_bd_intf_pins gt_quad_base_1/RX1_GT_IP_Interface]
connect_bd_intf_net [get_bd_intf_pins dcmac_0/gtm_rx_serdes_interface_6] [get_bd_intf_pins gt_quad_base_1/RX2_GT_IP_Interface]
connect_bd_intf_net [get_bd_intf_pins dcmac_0/gtm_rx_serdes_interface_7] [get_bd_intf_pins gt_quad_base_1/RX3_GT_IP_Interface]
connect_bd_intf_net [get_bd_intf_pins dcmac_0/gtm_tx_serdes_interface_0] [get_bd_intf_pins gt_quad_base_0/TX0_GT_IP_Interface]
connect_bd_intf_net [get_bd_intf_pins dcmac_0/gtm_tx_serdes_interface_1] [get_bd_intf_pins gt_quad_base_0/TX1_GT_IP_Interface]
connect_bd_intf_net [get_bd_intf_pins dcmac_0/gtm_tx_serdes_interface_2] [get_bd_intf_pins gt_quad_base_0/TX2_GT_IP_Interface]
connect_bd_intf_net [get_bd_intf_pins dcmac_0/gtm_tx_serdes_interface_3] [get_bd_intf_pins gt_quad_base_0/TX3_GT_IP_Interface]
connect_bd_intf_net [get_bd_intf_pins dcmac_0/gtm_tx_serdes_interface_4] [get_bd_intf_pins gt_quad_base_1/TX0_GT_IP_Interface]
connect_bd_intf_net [get_bd_intf_pins dcmac_0/gtm_tx_serdes_interface_5] [get_bd_intf_pins gt_quad_base_1/TX1_GT_IP_Interface]
connect_bd_intf_net [get_bd_intf_pins dcmac_0/gtm_tx_serdes_interface_6] [get_bd_intf_pins gt_quad_base_1/TX2_GT_IP_Interface]
connect_bd_intf_net [get_bd_intf_pins dcmac_0/gtm_tx_serdes_interface_7] [get_bd_intf_pins gt_quad_base_1/TX3_GT_IP_Interface]
connect_bd_intf_net [get_bd_intf_pins gt_quad_base_0/GT_NORTHOUT_SOUTHIN] [get_bd_intf_pins gt_quad_base_1/GT_NORTHIN_SOUTHOUT]
connect_bd_intf_net [get_bd_intf_pins GT_Serial_1] [get_bd_intf_pins gt_quad_base_1/GT_Serial]
connect_bd_intf_net [get_bd_intf_pins GT_Serial_0] [get_bd_intf_pins gt_quad_base_0/GT_Serial]
connect_bd_intf_net [get_bd_intf_pins s_axi] [get_bd_intf_pins dcmac_0/s_axi]
connect_bd_net [get_bd_pins apb3clk_quad] [get_bd_pins gt_quad_base_1/apb3clk] [get_bd_pins gt_quad_base_0/apb3clk]
connect_bd_net [get_bd_pins bufg_gt_odiv2/usrclk] [get_bd_pins IBUFDS_ODIV2]
connect_bd_net -net ch0_loopback_0_1 [get_bd_pins gt_loopback_0] \
  [get_bd_pins gt_quad_base_0/ch0_loopback] [get_bd_pins gt_quad_base_0/ch1_loopback] \
  [get_bd_pins gt_quad_base_0/ch2_loopback] [get_bd_pins gt_quad_base_0/ch3_loopback]
connect_bd_net -net ch0_loopback_1_1 [get_bd_pins gt_loopback_1] \
  [get_bd_pins gt_quad_base_1/ch0_loopback] [get_bd_pins gt_quad_base_1/ch1_loopback] \
  [get_bd_pins gt_quad_base_1/ch2_loopback] [get_bd_pins gt_quad_base_1/ch3_loopback]
connect_bd_net -net ch0_rxcdrhold_0_1 [get_bd_pins gt_rxcdrhold_0] \
  [get_bd_pins gt_quad_base_0/ch0_rxcdrhold] [get_bd_pins gt_quad_base_0/ch1_rxcdrhold] \
  [get_bd_pins gt_quad_base_0/ch2_rxcdrhold] [get_bd_pins gt_quad_base_0/ch3_rxcdrhold]
connect_bd_net [get_bd_pins dcmac_0/gt_rx_reset_done_out_0] [get_bd_pins gt_rx_reset_done_out_0]
connect_bd_net [get_bd_pins dcmac_0/gt_rx_reset_done_out_1] [get_bd_pins gt_rx_reset_done_out_1]
connect_bd_net [get_bd_pins dcmac_0/gt_rx_reset_done_out_2] [get_bd_pins gt_rx_reset_done_out_2]
connect_bd_net [get_bd_pins dcmac_0/gt_rx_reset_done_out_3] [get_bd_pins gt_rx_reset_done_out_3]
connect_bd_net [get_bd_pins dcmac_0/gt_rx_reset_done_out_4] [get_bd_pins gt_rx_reset_done_out_4]
connect_bd_net [get_bd_pins dcmac_0/gt_rx_reset_done_out_5] [get_bd_pins gt_rx_reset_done_out_5]
connect_bd_net [get_bd_pins dcmac_0/gt_rx_reset_done_out_6] [get_bd_pins gt_rx_reset_done_out_6]
connect_bd_net [get_bd_pins dcmac_0/gt_rx_reset_done_out_7] [get_bd_pins gt_rx_reset_done_out_7]
connect_bd_net [get_bd_pins dcmac_0/gt_tx_reset_done_out_0] [get_bd_pins gt_tx_reset_done_out_0]
connect_bd_net [get_bd_pins dcmac_0/gt_tx_reset_done_out_1] [get_bd_pins gt_tx_reset_done_out_1]
connect_bd_net [get_bd_pins dcmac_0/gt_tx_reset_done_out_2] [get_bd_pins gt_tx_reset_done_out_2]
connect_bd_net [get_bd_pins dcmac_0/gt_tx_reset_done_out_3] [get_bd_pins gt_tx_reset_done_out_3]
connect_bd_net [get_bd_pins dcmac_0/gt_tx_reset_done_out_4] [get_bd_pins gt_tx_reset_done_out_4]
connect_bd_net [get_bd_pins dcmac_0/gt_tx_reset_done_out_5] [get_bd_pins gt_tx_reset_done_out_5]
connect_bd_net [get_bd_pins dcmac_0/gt_tx_reset_done_out_6] [get_bd_pins gt_tx_reset_done_out_6]
connect_bd_net [get_bd_pins dcmac_0/gt_tx_reset_done_out_7] [get_bd_pins gt_tx_reset_done_out_7]
connect_bd_net [get_bd_pins dcmac_0/iloreset_out_0] [get_bd_pins gt_quad_base_0/ch0_iloreset]
connect_bd_net [get_bd_pins dcmac_0/iloreset_out_1] [get_bd_pins gt_quad_base_0/ch1_iloreset]
connect_bd_net [get_bd_pins dcmac_0/iloreset_out_2] [get_bd_pins gt_quad_base_0/ch2_iloreset]
connect_bd_net [get_bd_pins dcmac_0/iloreset_out_3] [get_bd_pins gt_quad_base_0/ch3_iloreset]
connect_bd_net [get_bd_pins dcmac_0/iloreset_out_4] [get_bd_pins gt_quad_base_1/ch0_iloreset]
connect_bd_net [get_bd_pins dcmac_0/iloreset_out_5] [get_bd_pins gt_quad_base_1/ch1_iloreset]
connect_bd_net [get_bd_pins dcmac_0/iloreset_out_6] [get_bd_pins gt_quad_base_1/ch2_iloreset]
connect_bd_net [get_bd_pins dcmac_0/iloreset_out_7] [get_bd_pins gt_quad_base_1/ch3_iloreset]
connect_bd_net [get_bd_pins dcmac_0/pllreset_out_0] \
  [get_bd_pins gt_quad_base_0/hsclk0_lcpllreset] [get_bd_pins gt_quad_base_0/hsclk1_lcpllreset] \
  [get_bd_pins gt_quad_base_0/hsclk0_rpllreset] [get_bd_pins gt_quad_base_0/hsclk1_rpllreset]
connect_bd_net [get_bd_pins dcmac_0/pllreset_out_1] \
  [get_bd_pins gt_quad_base_1/hsclk0_lcpllreset] [get_bd_pins gt_quad_base_1/hsclk0_rpllreset] \
  [get_bd_pins gt_quad_base_1/hsclk1_lcpllreset] [get_bd_pins gt_quad_base_1/hsclk1_rpllreset]
connect_bd_net [get_bd_pins dcmac_0/rx_axis_tdata0] [get_bd_pins rx_axis_tdata0]
connect_bd_net [get_bd_pins dcmac_0/rx_axis_tdata1] [get_bd_pins rx_axis_tdata1]
connect_bd_net [get_bd_pins dcmac_0/rx_axis_tdata2] [get_bd_pins rx_axis_tdata2]
connect_bd_net [get_bd_pins dcmac_0/rx_axis_tdata3] [get_bd_pins rx_axis_tdata3]
connect_bd_net [get_bd_pins dcmac_0/rx_axis_tuser_ena0] [get_bd_pins rx_axis_tuser_ena0]
connect_bd_net [get_bd_pins dcmac_0/rx_axis_tuser_ena1] [get_bd_pins rx_axis_tuser_ena1]
connect_bd_net [get_bd_pins dcmac_0/rx_axis_tuser_ena2] [get_bd_pins rx_axis_tuser_ena2]
connect_bd_net [get_bd_pins dcmac_0/rx_axis_tuser_ena3] [get_bd_pins rx_axis_tuser_ena3]
connect_bd_net [get_bd_pins dcmac_0/rx_axis_tuser_eop0] [get_bd_pins rx_axis_tuser_eop0]
connect_bd_net [get_bd_pins dcmac_0/rx_axis_tuser_eop1] [get_bd_pins rx_axis_tuser_eop1]
connect_bd_net [get_bd_pins dcmac_0/rx_axis_tuser_eop2] [get_bd_pins rx_axis_tuser_eop2]
connect_bd_net [get_bd_pins dcmac_0/rx_axis_tuser_eop3] [get_bd_pins rx_axis_tuser_eop3]
connect_bd_net [get_bd_pins dcmac_0/rx_axis_tuser_err0] [get_bd_pins rx_axis_tuser_err0]
connect_bd_net [get_bd_pins dcmac_0/rx_axis_tuser_err1] [get_bd_pins rx_axis_tuser_err1]
connect_bd_net [get_bd_pins dcmac_0/rx_axis_tuser_err2] [get_bd_pins rx_axis_tuser_err2]
connect_bd_net [get_bd_pins dcmac_0/rx_axis_tuser_err3] [get_bd_pins rx_axis_tuser_err3]
connect_bd_net [get_bd_pins dcmac_0/rx_axis_tuser_mty0] [get_bd_pins rx_axis_tuser_mty0]
connect_bd_net [get_bd_pins dcmac_0/rx_axis_tuser_mty1] [get_bd_pins rx_axis_tuser_mty1]
connect_bd_net [get_bd_pins dcmac_0/rx_axis_tuser_mty2] [get_bd_pins rx_axis_tuser_mty2]
connect_bd_net [get_bd_pins dcmac_0/rx_axis_tuser_mty3] [get_bd_pins rx_axis_tuser_mty3]
connect_bd_net [get_bd_pins dcmac_0/rx_axis_tuser_sop0] [get_bd_pins rx_axis_tuser_sop0]
connect_bd_net [get_bd_pins dcmac_0/rx_axis_tuser_sop1] [get_bd_pins rx_axis_tuser_sop1]
connect_bd_net [get_bd_pins dcmac_0/rx_axis_tuser_sop2] [get_bd_pins rx_axis_tuser_sop2]
connect_bd_net [get_bd_pins dcmac_0/rx_axis_tuser_sop3] [get_bd_pins rx_axis_tuser_sop3]
connect_bd_net [get_bd_pins dcmac_0/rx_axis_tvalid_0] [get_bd_pins rx_axis_tvalid_0]
connect_bd_net [get_bd_pins dcmac_0/rx_axis_tvalid_1] [get_bd_pins rx_axis_tvalid_1]
connect_bd_net [get_bd_pins dcmac_0/rx_clr_out_0] [get_bd_pins util_ds_buf_mbufg_rx_0/MBUFG_GT_CLR]
connect_bd_net [get_bd_pins dcmac_0/rx_clr_out_4] [get_bd_pins util_ds_buf_mbufg_rx_1/MBUFG_GT_CLR]
connect_bd_net [get_bd_pins dcmac_0/rx_clrb_leaf_out_0] [get_bd_pins util_ds_buf_mbufg_rx_0/MBUFG_GT_CLRB_LEAF]
connect_bd_net [get_bd_pins dcmac_0/rx_clrb_leaf_out_4] [get_bd_pins util_ds_buf_mbufg_rx_1/MBUFG_GT_CLRB_LEAF]
connect_bd_net [get_bd_pins dcmac_0/tx_axis_tready_0] [get_bd_pins tx_axis_tready_0]
connect_bd_net [get_bd_pins dcmac_0/tx_axis_tready_1] [get_bd_pins tx_axis_tready_1]
connect_bd_net [get_bd_pins dcmac_0/tx_clr_out_0] [get_bd_pins util_ds_buf_mbufg_tx_0/MBUFG_GT_CLR]
connect_bd_net [get_bd_pins dcmac_0/tx_clr_out_4] [get_bd_pins util_ds_buf_mbufg_tx_1/MBUFG_GT_CLR]
connect_bd_net [get_bd_pins dcmac_0/tx_clrb_leaf_out_0] [get_bd_pins util_ds_buf_mbufg_tx_0/MBUFG_GT_CLRB_LEAF]
connect_bd_net [get_bd_pins dcmac_0/tx_clrb_leaf_out_4] [get_bd_pins util_ds_buf_mbufg_tx_1/MBUFG_GT_CLRB_LEAF]
connect_bd_net [get_bd_pins gt_quad_base_1/ch0_iloresetdone] [get_bd_pins dcmac_0/ilo_reset_done_4]
connect_bd_net [get_bd_pins gt_quad_base_1/ch0_rxoutclk] [get_bd_pins util_ds_buf_mbufg_rx_1/MBUFG_GT_I]
connect_bd_net [get_bd_pins gt_quad_base_1/ch0_txoutclk] [get_bd_pins util_ds_buf_mbufg_tx_1/MBUFG_GT_I]
connect_bd_net [get_bd_pins gt_quad_base_1/ch1_iloresetdone] [get_bd_pins dcmac_0/ilo_reset_done_5]
connect_bd_net [get_bd_pins gt_quad_base_1/ch2_iloresetdone] [get_bd_pins dcmac_0/ilo_reset_done_6]
connect_bd_net [get_bd_pins gt_quad_base_1/ch3_iloresetdone] [get_bd_pins dcmac_0/ilo_reset_done_7]
connect_bd_net [get_bd_pins gt_quad_base_1/gtpowergood] [get_bd_pins gtpowergood_1]
connect_bd_net [get_bd_pins gt_quad_base_1/hsclk0_lcplllock] [get_bd_pins dcmac_0/plllock_in_1]
connect_bd_net -net gt_quad_base_ch0_iloresetdone [get_bd_pins gt_quad_base_0/ch0_iloresetdone] [get_bd_pins dcmac_0/ilo_reset_done_0]
connect_bd_net -net gt_quad_base_ch0_rxoutclk [get_bd_pins gt_quad_base_0/ch0_rxoutclk] [get_bd_pins util_ds_buf_mbufg_rx_0/MBUFG_GT_I]
connect_bd_net -net gt_quad_base_ch0_txoutclk [get_bd_pins gt_quad_base_0/ch0_txoutclk] [get_bd_pins util_ds_buf_mbufg_tx_0/MBUFG_GT_I]
connect_bd_net -net gt_quad_base_ch1_iloresetdone [get_bd_pins gt_quad_base_0/ch1_iloresetdone] [get_bd_pins dcmac_0/ilo_reset_done_1]
connect_bd_net -net gt_quad_base_ch2_iloresetdone [get_bd_pins gt_quad_base_0/ch2_iloresetdone] [get_bd_pins dcmac_0/ilo_reset_done_2]
connect_bd_net -net gt_quad_base_ch3_iloresetdone [get_bd_pins gt_quad_base_0/ch3_iloresetdone] [get_bd_pins dcmac_0/ilo_reset_done_3]
connect_bd_net -net gt_quad_base_gtpowergood [get_bd_pins gt_quad_base_0/gtpowergood] [get_bd_pins gtpowergood_0]
connect_bd_net -net gt_quad_base_hsclk0_lcplllock [get_bd_pins gt_quad_base_0/hsclk0_lcplllock] [get_bd_pins dcmac_0/plllock_in_0]
connect_bd_net [get_bd_pins gt_reset_all_in] [get_bd_pins dcmac_0/gt_reset_all_in]
connect_bd_net -net gt_reset_rx_datapath_in_0_1 [get_bd_pins gt_reset_rx_datapath_in_0] \
  [get_bd_pins dcmac_0/gt_reset_rx_datapath_in_0] [get_bd_pins dcmac_0/gt_reset_rx_datapath_in_1] \
  [get_bd_pins dcmac_0/gt_reset_rx_datapath_in_2] [get_bd_pins dcmac_0/gt_reset_rx_datapath_in_3]
connect_bd_net -net gt_reset_rx_datapath_in_4_1 [get_bd_pins gt_reset_rx_datapath_in_1] \
  [get_bd_pins dcmac_0/gt_reset_rx_datapath_in_4] [get_bd_pins dcmac_0/gt_reset_rx_datapath_in_5] \
  [get_bd_pins dcmac_0/gt_reset_rx_datapath_in_6] [get_bd_pins dcmac_0/gt_reset_rx_datapath_in_7]
connect_bd_net -net gt_reset_tx_datapath_in_0_1 [get_bd_pins gt_reset_tx_datapath_in_0] \
  [get_bd_pins dcmac_0/gt_reset_tx_datapath_in_0] [get_bd_pins dcmac_0/gt_reset_tx_datapath_in_1] \
  [get_bd_pins dcmac_0/gt_reset_tx_datapath_in_2] [get_bd_pins dcmac_0/gt_reset_tx_datapath_in_3]
connect_bd_net -net gt_reset_tx_datapath_in_4_1 [get_bd_pins gt_reset_tx_datapath_in_1] \
  [get_bd_pins dcmac_0/gt_reset_tx_datapath_in_4] [get_bd_pins dcmac_0/gt_reset_tx_datapath_in_5] \
  [get_bd_pins dcmac_0/gt_reset_tx_datapath_in_7] [get_bd_pins dcmac_0/gt_reset_tx_datapath_in_6]
connect_bd_net [get_bd_pins gt_rxcdrhold_1] \
  [get_bd_pins gt_quad_base_1/ch0_rxcdrhold] [get_bd_pins gt_quad_base_1/ch1_rxcdrhold] \
  [get_bd_pins gt_quad_base_1/ch2_rxcdrhold] [get_bd_pins gt_quad_base_1/ch3_rxcdrhold]
connect_bd_net [get_bd_pins gt_txmaincursor] \
  [get_bd_pins gt_quad_base_0/ch1_txmaincursor] [get_bd_pins gt_quad_base_0/ch2_txmaincursor] \
  [get_bd_pins gt_quad_base_0/ch3_txmaincursor] [get_bd_pins gt_quad_base_1/ch0_txmaincursor] \
  [get_bd_pins gt_quad_base_1/ch1_txmaincursor] [get_bd_pins gt_quad_base_1/ch2_txmaincursor] \
  [get_bd_pins gt_quad_base_1/ch3_txmaincursor] [get_bd_pins gt_quad_base_0/ch0_txmaincursor]
connect_bd_net [get_bd_pins gt_txpostcursor] \
  [get_bd_pins gt_quad_base_0/ch1_txpostcursor] [get_bd_pins gt_quad_base_0/ch2_txpostcursor] \
  [get_bd_pins gt_quad_base_0/ch3_txpostcursor] [get_bd_pins gt_quad_base_1/ch0_txpostcursor] \
  [get_bd_pins gt_quad_base_1/ch1_txpostcursor] [get_bd_pins gt_quad_base_1/ch2_txpostcursor] \
  [get_bd_pins gt_quad_base_1/ch3_txpostcursor] [get_bd_pins gt_quad_base_0/ch0_txpostcursor]
connect_bd_net [get_bd_pins gt_txprecursor] \
  [get_bd_pins gt_quad_base_0/ch1_txprecursor] [get_bd_pins gt_quad_base_0/ch2_txprecursor] \
  [get_bd_pins gt_quad_base_0/ch3_txprecursor] [get_bd_pins gt_quad_base_1/ch0_txprecursor] \
  [get_bd_pins gt_quad_base_1/ch1_txprecursor] [get_bd_pins gt_quad_base_1/ch2_txprecursor] \
  [get_bd_pins gt_quad_base_1/ch3_txprecursor] [get_bd_pins gt_quad_base_0/ch0_txprecursor]
connect_bd_net [get_bd_pins gtpowergood_in] [get_bd_pins dcmac_0/gtpowergood_in]
connect_bd_net [get_bd_pins rx_alt_serdes_clk] [get_bd_pins dcmac_0/rx_alt_serdes_clk]
connect_bd_net [get_bd_pins rx_axi_clk] [get_bd_pins dcmac_0/rx_axi_clk]
connect_bd_net [get_bd_pins rx_core_clk] [get_bd_pins dcmac_0/rx_core_clk]
connect_bd_net [get_bd_pins rx_flexif_clk] [get_bd_pins dcmac_0/rx_flexif_clk]
connect_bd_net [get_bd_pins rx_macif_clk] [get_bd_pins dcmac_0/rx_macif_clk]
connect_bd_net [get_bd_pins rx_serdes_clk] [get_bd_pins dcmac_0/rx_serdes_clk]
connect_bd_net [get_bd_pins s_axi_aclk] [get_bd_pins dcmac_0/s_axi_aclk]
connect_bd_net [get_bd_pins s_axi_aresetn] \
  [get_bd_pins gt_quad_base_1/apb3presetn] [get_bd_pins dcmac_0/s_axi_aresetn] [get_bd_pins gt_quad_base_0/apb3presetn]
connect_bd_net [get_bd_pins ts_clk] [get_bd_pins dcmac_0/ts_clk]
connect_bd_net [get_bd_pins tx_alt_serdes_clk] [get_bd_pins dcmac_0/tx_alt_serdes_clk]
connect_bd_net [get_bd_pins tx_axi_clk] [get_bd_pins dcmac_0/tx_axi_clk]
connect_bd_net -net tx_axis_tdata0_1 [get_bd_pins tx_axis_tdata0] [get_bd_pins dcmac_0/tx_axis_tdata0]
connect_bd_net -net tx_axis_tdata1_1 [get_bd_pins tx_axis_tdata1] [get_bd_pins dcmac_0/tx_axis_tdata1]
connect_bd_net -net tx_axis_tdata2_1 [get_bd_pins tx_axis_tdata2] [get_bd_pins dcmac_0/tx_axis_tdata2]
connect_bd_net -net tx_axis_tdata3_1 [get_bd_pins tx_axis_tdata3] [get_bd_pins dcmac_0/tx_axis_tdata3]
connect_bd_net -net tx_axis_tuser_ena0_1 [get_bd_pins tx_axis_tuser_ena0] [get_bd_pins dcmac_0/tx_axis_tuser_ena0]
connect_bd_net -net tx_axis_tuser_ena1_1 [get_bd_pins tx_axis_tuser_ena1] [get_bd_pins dcmac_0/tx_axis_tuser_ena1]
connect_bd_net -net tx_axis_tuser_ena2_1 [get_bd_pins tx_axis_tuser_ena2] [get_bd_pins dcmac_0/tx_axis_tuser_ena2]
connect_bd_net -net tx_axis_tuser_ena3_1 [get_bd_pins tx_axis_tuser_ena3] [get_bd_pins dcmac_0/tx_axis_tuser_ena3]
connect_bd_net -net tx_axis_tuser_eop0_1 [get_bd_pins tx_axis_tuser_eop0] [get_bd_pins dcmac_0/tx_axis_tuser_eop0]
connect_bd_net -net tx_axis_tuser_eop1_1 [get_bd_pins tx_axis_tuser_eop1] [get_bd_pins dcmac_0/tx_axis_tuser_eop1]
connect_bd_net -net tx_axis_tuser_eop2_1 [get_bd_pins tx_axis_tuser_eop2] [get_bd_pins dcmac_0/tx_axis_tuser_eop2]
connect_bd_net -net tx_axis_tuser_eop3_1 [get_bd_pins tx_axis_tuser_eop3] [get_bd_pins dcmac_0/tx_axis_tuser_eop3]
connect_bd_net -net tx_axis_tuser_err0_1 [get_bd_pins tx_axis_tuser_err0] [get_bd_pins dcmac_0/tx_axis_tuser_err0]
connect_bd_net -net tx_axis_tuser_err1_1 [get_bd_pins tx_axis_tuser_err1] [get_bd_pins dcmac_0/tx_axis_tuser_err1]
connect_bd_net -net tx_axis_tuser_err2_1 [get_bd_pins tx_axis_tuser_err2] [get_bd_pins dcmac_0/tx_axis_tuser_err2]
connect_bd_net -net tx_axis_tuser_err3_1 [get_bd_pins tx_axis_tuser_err3] [get_bd_pins dcmac_0/tx_axis_tuser_err3]
connect_bd_net -net tx_axis_tuser_mty0_1 [get_bd_pins tx_axis_tuser_mty0] [get_bd_pins dcmac_0/tx_axis_tuser_mty0]
connect_bd_net -net tx_axis_tuser_mty1_1 [get_bd_pins tx_axis_tuser_mty1] [get_bd_pins dcmac_0/tx_axis_tuser_mty1]
connect_bd_net -net tx_axis_tuser_mty2_1 [get_bd_pins tx_axis_tuser_mty2] [get_bd_pins dcmac_0/tx_axis_tuser_mty2]
connect_bd_net -net tx_axis_tuser_mty3_1 [get_bd_pins tx_axis_tuser_mty3] [get_bd_pins dcmac_0/tx_axis_tuser_mty3]
connect_bd_net -net tx_axis_tuser_sop0_1 [get_bd_pins tx_axis_tuser_sop0] [get_bd_pins dcmac_0/tx_axis_tuser_sop0]
connect_bd_net -net tx_axis_tuser_sop1_1 [get_bd_pins tx_axis_tuser_sop1] [get_bd_pins dcmac_0/tx_axis_tuser_sop1]
connect_bd_net -net tx_axis_tuser_sop2_1 [get_bd_pins tx_axis_tuser_sop2] [get_bd_pins dcmac_0/tx_axis_tuser_sop2]
connect_bd_net -net tx_axis_tuser_sop3_1 [get_bd_pins tx_axis_tuser_sop3] [get_bd_pins dcmac_0/tx_axis_tuser_sop3]
connect_bd_net -net tx_axis_tvalid_0_1 [get_bd_pins tx_axis_tvalid_0] [get_bd_pins dcmac_0/tx_axis_tvalid_0]
connect_bd_net -net tx_axis_tvalid_1_1 [get_bd_pins tx_axis_tvalid_1] [get_bd_pins dcmac_0/tx_axis_tvalid_1]
connect_bd_net [get_bd_pins tx_core_clk] [get_bd_pins dcmac_0/tx_core_clk]
connect_bd_net [get_bd_pins tx_flexif_clk] [get_bd_pins dcmac_0/tx_flexif_clk]
connect_bd_net [get_bd_pins tx_macif_clk] [get_bd_pins dcmac_0/tx_macif_clk]
connect_bd_net [get_bd_pins tx_serdes_clk] [get_bd_pins dcmac_0/tx_serdes_clk]
connect_bd_net [get_bd_pins util_ds_buf_0/IBUFDS_GTME5_O] [get_bd_pins gt_quad_base_0/GT_REFCLK0]
connect_bd_net [get_bd_pins util_ds_buf_0/IBUFDS_GTME5_ODIV2] [get_bd_pins bufg_gt_odiv2/outclk]
connect_bd_net [get_bd_pins util_ds_buf_1/IBUFDS_GTME5_O] [get_bd_pins gt_quad_base_1/GT_REFCLK0]
connect_bd_net [get_bd_pins util_ds_buf_mbufg_rx_0/MBUFG_GT_O1] [get_bd_pins ch0_rx_usr_clk_0]
connect_bd_net [get_bd_pins util_ds_buf_mbufg_rx_0/MBUFG_GT_O2] \
  [get_bd_pins ch0_rx_usr_clk2_0] [get_bd_pins gt_quad_base_0/ch1_rxusrclk] [get_bd_pins gt_quad_base_0/ch2_rxusrclk] \
  [get_bd_pins gt_quad_base_0/ch3_rxusrclk] [get_bd_pins gt_quad_base_0/ch0_rxusrclk]
connect_bd_net [get_bd_pins util_ds_buf_mbufg_rx_1/MBUFG_GT_O1] [get_bd_pins ch0_rx_usr_clk_1]
connect_bd_net [get_bd_pins util_ds_buf_mbufg_rx_1/MBUFG_GT_O2] \
  [get_bd_pins ch0_rx_usr_clk2_1] [get_bd_pins gt_quad_base_1/ch0_rxusrclk] [get_bd_pins gt_quad_base_1/ch1_rxusrclk] \
  [get_bd_pins gt_quad_base_1/ch2_rxusrclk] [get_bd_pins gt_quad_base_1/ch3_rxusrclk]
connect_bd_net [get_bd_pins util_ds_buf_mbufg_tx_0/MBUFG_GT_O1] [get_bd_pins ch0_tx_usr_clk_0]
connect_bd_net [get_bd_pins util_ds_buf_mbufg_tx_0/MBUFG_GT_O2] \
  [get_bd_pins ch0_tx_usr_clk2_0] [get_bd_pins gt_quad_base_0/ch1_txusrclk] [get_bd_pins gt_quad_base_0/ch2_txusrclk] \
  [get_bd_pins gt_quad_base_0/ch3_txusrclk] [get_bd_pins gt_quad_base_0/ch0_txusrclk]
connect_bd_net [get_bd_pins util_ds_buf_mbufg_tx_1/MBUFG_GT_O1] [get_bd_pins ch0_tx_usr_clk_1]
connect_bd_net [get_bd_pins util_ds_buf_mbufg_tx_1/MBUFG_GT_O2] \
  [get_bd_pins ch0_tx_usr_clk2_1] [get_bd_pins gt_quad_base_1/ch0_txusrclk] [get_bd_pins gt_quad_base_1/ch1_txusrclk] \
  [get_bd_pins gt_quad_base_1/ch2_txusrclk] [get_bd_pins gt_quad_base_1/ch3_txusrclk]
connect_bd_net [get_bd_pins xlconstant_0/dout] \
  [get_bd_pins util_ds_buf_mbufg_tx_0/MBUFG_GT_CE] [get_bd_pins util_ds_buf_mbufg_rx_0/MBUFG_GT_CE] \
  [get_bd_pins util_ds_buf_mbufg_tx_1/MBUFG_GT_CE] [get_bd_pins util_ds_buf_mbufg_rx_1/MBUFG_GT_CE]

current_bd_instance /rx0
connect_bd_intf_net [get_bd_intf_pins dcmac_to_axis64/m_axis] [get_bd_intf_pins rx_user]
connect_bd_intf_net [get_bd_intf_pins dcmac_rx_deskew/in0] [get_bd_intf_pins dcmac_rx/seg0]
connect_bd_intf_net [get_bd_intf_pins dcmac_rx_deskew/in1] [get_bd_intf_pins dcmac_rx/seg1]
connect_bd_intf_net [get_bd_intf_pins dcmac_rx_deskew/in2] [get_bd_intf_pins dcmac_rx/seg2]
connect_bd_intf_net [get_bd_intf_pins dcmac_rx_deskew/in3] [get_bd_intf_pins dcmac_rx/seg3]
connect_bd_intf_net [get_bd_intf_pins dcmac_rx_2to4/out0] [get_bd_intf_pins dcmac_to_axis64/in0]
connect_bd_intf_net [get_bd_intf_pins dcmac_rx_2to4/out1] [get_bd_intf_pins dcmac_to_axis64/in1]
connect_bd_intf_net [get_bd_intf_pins dcmac_rx_2to4/out2] [get_bd_intf_pins dcmac_to_axis64/in2]
connect_bd_intf_net [get_bd_intf_pins dcmac_rx_2to4/out3] [get_bd_intf_pins dcmac_to_axis64/in3]
connect_bd_intf_net [get_bd_intf_pins dcmac_rx_2to4/in0] [get_bd_intf_pins dcmac_rx_deskew/out0]
connect_bd_intf_net [get_bd_intf_pins dcmac_rx_2to4/in1] [get_bd_intf_pins dcmac_rx_deskew/out1]
connect_bd_net -net clk_wizard_axis_clk [get_bd_pins axis_clk] \
  [get_bd_pins dcmac_rx_2to4/clk] [get_bd_pins dcmac_rx/clk] [get_bd_pins dcmac_to_axis64/s_clk] \
  [get_bd_pins dcmac_rx_deskew/clk]
connect_bd_net -net data0_1 [get_bd_pins data0] [get_bd_pins dcmac_rx/i_data0]
connect_bd_net -net data1_1 [get_bd_pins data1] [get_bd_pins dcmac_rx/i_data1]
connect_bd_net -net dcmac_helper_axis0_resetn [get_bd_pins axis_resetn] \
  [get_bd_pins dcmac_rx_2to4/resetn] [get_bd_pins dcmac_rx/resetn] [get_bd_pins dcmac_to_axis64/s_resetn] \
  [get_bd_pins dcmac_rx_deskew/resetn]
connect_bd_net -net ena0_1 [get_bd_pins ena0] [get_bd_pins dcmac_rx/i_ena0]
connect_bd_net -net ena1_1 [get_bd_pins ena1] [get_bd_pins dcmac_rx/i_ena1]
connect_bd_net -net eop0_1 [get_bd_pins eop0] [get_bd_pins dcmac_rx/i_eop0]
connect_bd_net -net eop1_1 [get_bd_pins eop1] [get_bd_pins dcmac_rx/i_eop1]
connect_bd_net -net err0_1 [get_bd_pins err0] [get_bd_pins dcmac_rx/i_err0]
connect_bd_net -net err1_1 [get_bd_pins err1] [get_bd_pins dcmac_rx/i_err1]
connect_bd_net -net mty0_1 [get_bd_pins mty0] [get_bd_pins dcmac_rx/i_mty0]
connect_bd_net -net mty1_1 [get_bd_pins mty1] [get_bd_pins dcmac_rx/i_mty1]
connect_bd_net -net rx0_user_clk_1 [get_bd_pins rx_user_clk] [get_bd_pins dcmac_to_axis64/m_axis_clk]
connect_bd_net -net sop0_1 [get_bd_pins sop0] [get_bd_pins dcmac_rx/i_sop0]
connect_bd_net -net sop1_1 [get_bd_pins sop1] [get_bd_pins dcmac_rx/i_sop1]
connect_bd_net [get_bd_pins tvalid] [get_bd_pins dcmac_rx/i_valid]
connect_bd_net [get_bd_pins zero_128/dout] [get_bd_pins dcmac_rx/i_data2] [get_bd_pins dcmac_rx/i_data3]
connect_bd_net [get_bd_pins zero_4/dout] [get_bd_pins dcmac_rx/i_mty2] [get_bd_pins dcmac_rx/i_mty3]
connect_bd_net [get_bd_pins zero/dout] \
  [get_bd_pins dcmac_rx/i_ena2] [get_bd_pins dcmac_rx/i_ena3] [get_bd_pins dcmac_rx/i_err2] [get_bd_pins dcmac_rx/i_err3] \
  [get_bd_pins dcmac_rx/i_sop2] [get_bd_pins dcmac_rx/i_sop3] [get_bd_pins dcmac_rx/i_eop2] [get_bd_pins dcmac_rx/i_eop3]

current_bd_instance /tx0
connect_bd_intf_net [get_bd_intf_pins axis64_to_dcmac/axis_in] [get_bd_intf_pins tx_user]
connect_bd_intf_net [get_bd_intf_pins dcmac_packetizer/axis0_in] [get_bd_intf_pins axis64_to_dcmac/axis0_out]
connect_bd_intf_net [get_bd_intf_pins dcmac_packetizer/axis1_in] [get_bd_intf_pins axis64_to_dcmac/axis1_out]
connect_bd_intf_net [get_bd_intf_pins dcmac_packetizer/axis2_in] [get_bd_intf_pins axis64_to_dcmac/axis2_out]
connect_bd_intf_net [get_bd_intf_pins dcmac_packetizer/axis3_in] [get_bd_intf_pins axis64_to_dcmac/axis3_out]
connect_bd_intf_net [get_bd_intf_pins dcmac_packetizer/axis0_out] [get_bd_intf_pins dcmac_tx_2seg/axis0_in]
connect_bd_intf_net [get_bd_intf_pins dcmac_packetizer/axis1_out] [get_bd_intf_pins dcmac_tx_2seg/axis1_in]
connect_bd_intf_net [get_bd_intf_pins dcmac_packetizer/axis2_out] [get_bd_intf_pins dcmac_tx_2seg/axis2_in]
connect_bd_intf_net [get_bd_intf_pins dcmac_packetizer/axis3_out] [get_bd_intf_pins dcmac_tx_2seg/axis3_in]
connect_bd_net -net clk_wizard_axis_clk [get_bd_pins axis_clk] \
  [get_bd_pins dcmac_tx_2seg/clk] [get_bd_pins axis64_to_dcmac/m_axis_clk] [get_bd_pins dcmac_packetizer/clk]
connect_bd_net -net dcmac_helper_axis0_resetn [get_bd_pins axis_resetn] [get_bd_pins dcmac_tx_2seg/resetn] [get_bd_pins dcmac_packetizer/resetn]
connect_bd_net -net dcmac_ip_tx_axis_tready_0 [get_bd_pins tx_axis_ready] [get_bd_pins dcmac_tx_2seg/tx_axis_ready]
connect_bd_net -net tx0_user_clk_1 [get_bd_pins tx_user_clk] [get_bd_pins axis64_to_dcmac/s_axis_clk]
connect_bd_net -net tx0_user_resetn_1 [get_bd_pins tx_user_resetn] [get_bd_pins axis64_to_dcmac/s_resetn]
connect_bd_net -net tx_axis_tdata0_1 [get_bd_pins dcmac_tx_2seg/tx_axis_tdata0] [get_bd_pins tx_axis_tdata0]
connect_bd_net -net tx_axis_tdata1_1 [get_bd_pins dcmac_tx_2seg/tx_axis_tdata1] [get_bd_pins tx_axis_tdata1]
connect_bd_net -net tx_axis_tuser_ena0_1 [get_bd_pins dcmac_tx_2seg/tx_axis_tuser_ena0] [get_bd_pins tx_axis_tuser_ena0]
connect_bd_net -net tx_axis_tuser_ena1_1 [get_bd_pins dcmac_tx_2seg/tx_axis_tuser_ena1] [get_bd_pins tx_axis_tuser_ena1]
connect_bd_net -net tx_axis_tuser_eop0_1 [get_bd_pins dcmac_tx_2seg/tx_axis_tuser_eop0] [get_bd_pins tx_axis_tuser_eop0]
connect_bd_net -net tx_axis_tuser_eop1_1 [get_bd_pins dcmac_tx_2seg/tx_axis_tuser_eop1] [get_bd_pins tx_axis_tuser_eop1]
connect_bd_net -net tx_axis_tuser_err0_1 [get_bd_pins dcmac_tx_2seg/tx_axis_tuser_err0] [get_bd_pins tx_axis_tuser_err0]
connect_bd_net -net tx_axis_tuser_err1_1 [get_bd_pins dcmac_tx_2seg/tx_axis_tuser_err1] [get_bd_pins tx_axis_tuser_err1]
connect_bd_net -net tx_axis_tuser_mty0_1 [get_bd_pins dcmac_tx_2seg/tx_axis_tuser_mty0] [get_bd_pins tx_axis_tuser_mty0]
connect_bd_net -net tx_axis_tuser_mty1_1 [get_bd_pins dcmac_tx_2seg/tx_axis_tuser_mty1] [get_bd_pins tx_axis_tuser_mty1]
connect_bd_net -net tx_axis_tuser_sop0_1 [get_bd_pins dcmac_tx_2seg/tx_axis_tuser_sop0] [get_bd_pins tx_axis_tuser_sop0]
connect_bd_net -net tx_axis_tuser_sop1_1 [get_bd_pins dcmac_tx_2seg/tx_axis_tuser_sop1] [get_bd_pins tx_axis_tuser_sop1]
connect_bd_net -net tx_axis_tvalid_0_1 [get_bd_pins dcmac_tx_2seg/tx_axis_valid] [get_bd_pins tx_axis_valid]
